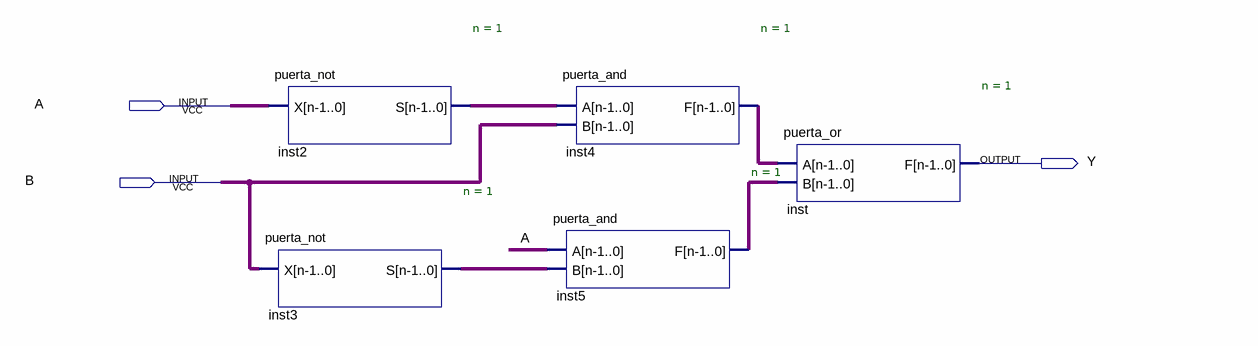
[diagram p0: schematic sheet]
// Quartus schematic Ejemplo4.bdf as structural Verilog: 5 symbols, 3 pins
module Ejemplo4 (
  input  A,
  input  B,
  output Y
);

  wire inst2_s, inst3_s, inst4_f, inst5_f;

  puerta_not #(.n(1)) inst2 (.X(A), .S(inst2_s));
  puerta_not #(.n(1)) inst3 (.X(B), .S(inst3_s));
  puerta_and #(.n(1)) inst5 (.A(A), .B(inst3_s), .F(inst5_f));
  puerta_and #(.n(1)) inst4 (.A(inst2_s), .B(B), .F(inst4_f));
  puerta_or #(.n(1)) inst (.A(inst4_f), .B(inst5_f), .F(Y));
endmodule
